# EAGLE design 4440 (EAGLE 7.5.0)
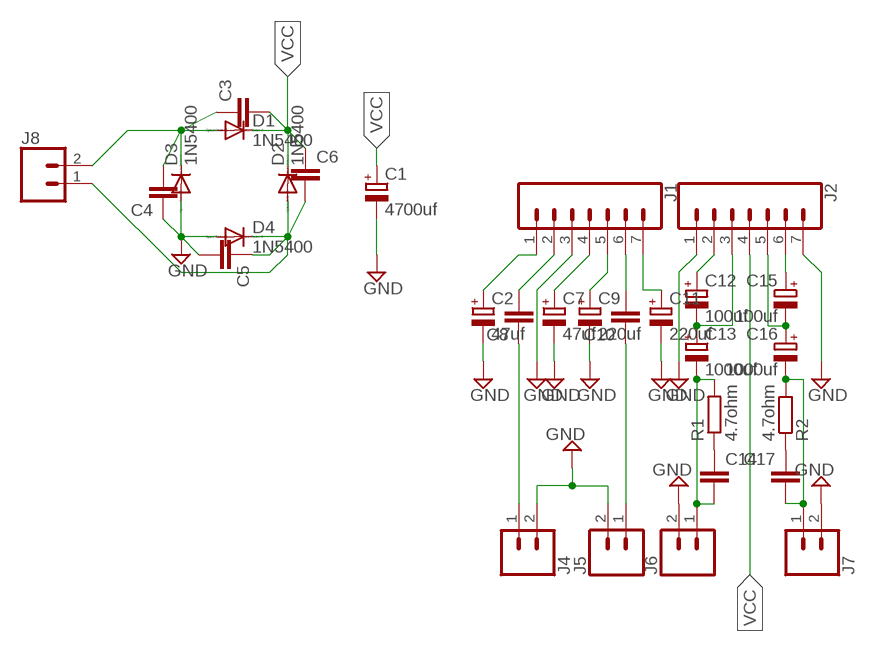
[diagram p0: schematic, sheet 1]

## Parts
C1  4700uf  CPOL-EUE7.5-16  [E7,5-16]
C2  47uf  CPOL-EUE3.5-8  [E3,5-8]
C3  C-EU050-055X075  [C050-055X075]
C4  C-EU050-055X075  [C050-055X075]
C5  C-EU050-055X075  [C050-055X075]
C6  C-EU050-055X075  [C050-055X075]
C7  47uf  CPOL-EUE3.5-8  [E3,5-8]
C8  C-EU050-055X075  [C050-055X075]
C9  220uf  CPOL-EUE3.5-8  [E3,5-8]
C10  C-EU050-055X075  [C050-055X075]
C11  220uf  CPOL-EUE3.5-8  [E3,5-8]
C12  100uf  CPOL-EUE3.5-8  [E3,5-8]
C13  1000uf  CPOL-EUE7.5-16  [E7,5-16]
C14  C-EU050-055X075  [C050-055X075]
C15  100uf  CPOL-EUE3.5-8  [E3,5-8]
C16  1000uf  CPOL-EUE7.5-16  [E7,5-16]
C17  C-EU050-055X075  [C050-055X075]
D1  1N5400  [DO201-15]
D2  1N5400  [DO201-15]
D3  1N5400  [DO201-15]
D4  1N5400  [DO201-15]
J1  CONN_07LONGPADS  [1X07_LONGPADS]
J2  CONN_07LONGPADS  [1X07_LONGPADS]
J4  CONN_023.5MM-NO_SILK  [SCREWTERMINAL-3.5MM-2-NS]
J5  CONN_023.5MM-NO_SILK  [SCREWTERMINAL-3.5MM-2-NS]
J6  CONN_023.5MM-NO_SILK  [SCREWTERMINAL-3.5MM-2-NS]
J7  CONN_023.5MM-NO_SILK  [SCREWTERMINAL-3.5MM-2-NS]
J8  CONN_023.5MM-NO_SILK  [SCREWTERMINAL-3.5MM-2-NS]
R1  4.7ohm  R-EU_0207/12  [0207/12]
R2  4.7ohm  R-EU_0207/12  [0207/12]

## Nets
GND: C1.- C2.- C4.1 C5.2 C7.- C9.- C11.- D3.A D4.A J1.3 J2.1 J2.7 J4.2 J5.2 J6.2 J7.2
N$1: C2.+ J1.1
N$2: C5.1 C6.2 D2.A D4.C J8.1
N$3: C8.2 J1.2
N$4: C3.1 C4.2 D1.A D3.C J8.2
N$5: C7.+ J1.4
N$6: C9.+ J1.5
N$7: C8.1 J4.1
N$8: C10.1 J5.1
N$9: C10.2 J1.6
N$10: C11.+ J1.7
N$11: C13.- C14.2 J6.1 R1.2
N$12: C12.+ J2.2
N$13: C12.- C13.+ J2.3
N$14: C15.+ J2.6
N$15: C14.1 R1.1
N$16: C15.- C16.+ J2.5
N$18: C17.1 R2.1
N$19: C16.- C17.2 J7.1 R2.2
VCC: C1.+ C3.2 C6.1 D1.C D2.C J2.4

## Library data of the parts
C1 C2 C7 C9 C11-C13 C15 C16 = rcl:CPOL-EU: POLARIZED CAPACITOR, European symbol
C3-C6 C8 C10 C14 C17 = rcl:C-EU: CAPACITOR, European symbol
D1-D4 = diode:1N5400: DIODE standard rectifier, 3 A, 50 V (Motorola)
J1 J2 = SparkFun-Connectors:CONN_07: Multi connection point. Often used as Generic Header-pin footprint for 0.1 inch spaced/style header connections On any of the 0.1 inch spaced packages, you can populate with these: Break Away Headers - Straight <https://www.sparkfun.com/products/116> (PRT-00116) Break Away Male Headers - Right Angle <https://www.sparkfun.com/products/553> (PRT-00553) Female Headers <https://www.sparkfun.com/products/115> (PRT-00115) Break Away Headers - Machine Pin <https://www.sparkfun.com/products/117> (PRT-00117) Break Away Female Headers - Swiss Machine Pin <https://www.sparkfun.com/products/743> (PRT-00743) For SCREWTERMINALS and SPRING TERMINALS visit here: Screw Terimnals on SparkFun.com <https://www.sparkfun.com/search/results?term=Screw+Terminals> (5mm/3.5mm/2.54mm spacing) This device is also useful as a general connection point to wire up your design to another part of your project. Our various solder wires solder well into these plated through hole pads. Hook-Up Wire - Assortment (Stranded, 22 AWG) <https://www.sparkfun.com/products/11375> (PRT-11375) Hook-Up Wire - Assortment (Solid Core, 22 AWG) <https://www.sparkfun.com/products/11367> (PRT-11367) View the entire wire category on our website here <https://www.sparkfun.com/categories/141> Special notes: Molex polarized connector foot print use with SKU : PRT-08231 with associated crimp pins and housings. 1MM SMD Version SKU: PRT-10208 NOTES ON THE VARIANTS LOCK and LOCK_LONGPADS... This footprint was designed to help hold the alignment of a through-hole component (i.e. 6-pin header) while soldering it into place. You may notice that each hole has been shifted either up or down by 0.005 of an inch from it's more standard position (which is a perfectly straight line). This slight alteration caused the pins (the squares in the middle) to touch the edges of the holes. Because they are alternating, it causes a "brace" to hold the component in place. 0.005 has proven to be the perfect amount of "off-center" position when using our standard breakaway headers. Although looks a little odd when you look at the bare footprint, once you have a header in there, the alteration is very hard to notice. Also,if you push a header all the way into place, it is covered up entirely on the bottom side.
J4-J8 = SparkFun-Retired:CONN_02: Multi connection point. Often used as Generic Header-pin footprint for 0.1 inch spaced/style header connections On any of the 0.1 inch spaced packages, you can populate with these: Break Away Headers - Straight <https://www.sparkfun.com/products/116> (PRT-00116) Break Away Male Headers - Right Angle <https://www.sparkfun.com/products/553> (PRT-00553) Female Headers <https://www.sparkfun.com/products/115> (PRT-00115) Break Away Headers - Machine Pin <https://www.sparkfun.com/products/117> (PRT-00117) Break Away Female Headers - Swiss Machine Pin <https://www.sparkfun.com/products/743> (PRT-00743) For SCREWTERMINALS and SPRING TERMINALS visit here: Screw Terimnals on SparkFun.com <https://www.sparkfun.com/search/results?term=Screw+Terminals> (5mm/3.5mm/2.54mm spacing) This device is also useful as a general connection point to wire up your design to another part of your project. Our various solder wires solder well into these plated through hole pads. Hook-Up Wire - Assortment (Stranded, 22 AWG) <https://www.sparkfun.com/products/11375> (PRT-11375) Hook-Up Wire - Assortment (Solid Core, 22 AWG) <https://www.sparkfun.com/products/11367> (PRT-11367) View the entire wire category on our website here <https://www.sparkfun.com/categories/141> Special notes: Molex polarized connector foot print use with: PRT-08233 with associated crimp pins and housings. 2.54_SCREWTERM for use with PRT-10571. 3.5mm Screw Terminal footprints for PRT-08084 5mm Screw Terminal footprints for use with PRT-08432; PROD_ID: CONN-08399
R1 R2 = resistor:R-EU_: RESISTOR, European symbol

## Board
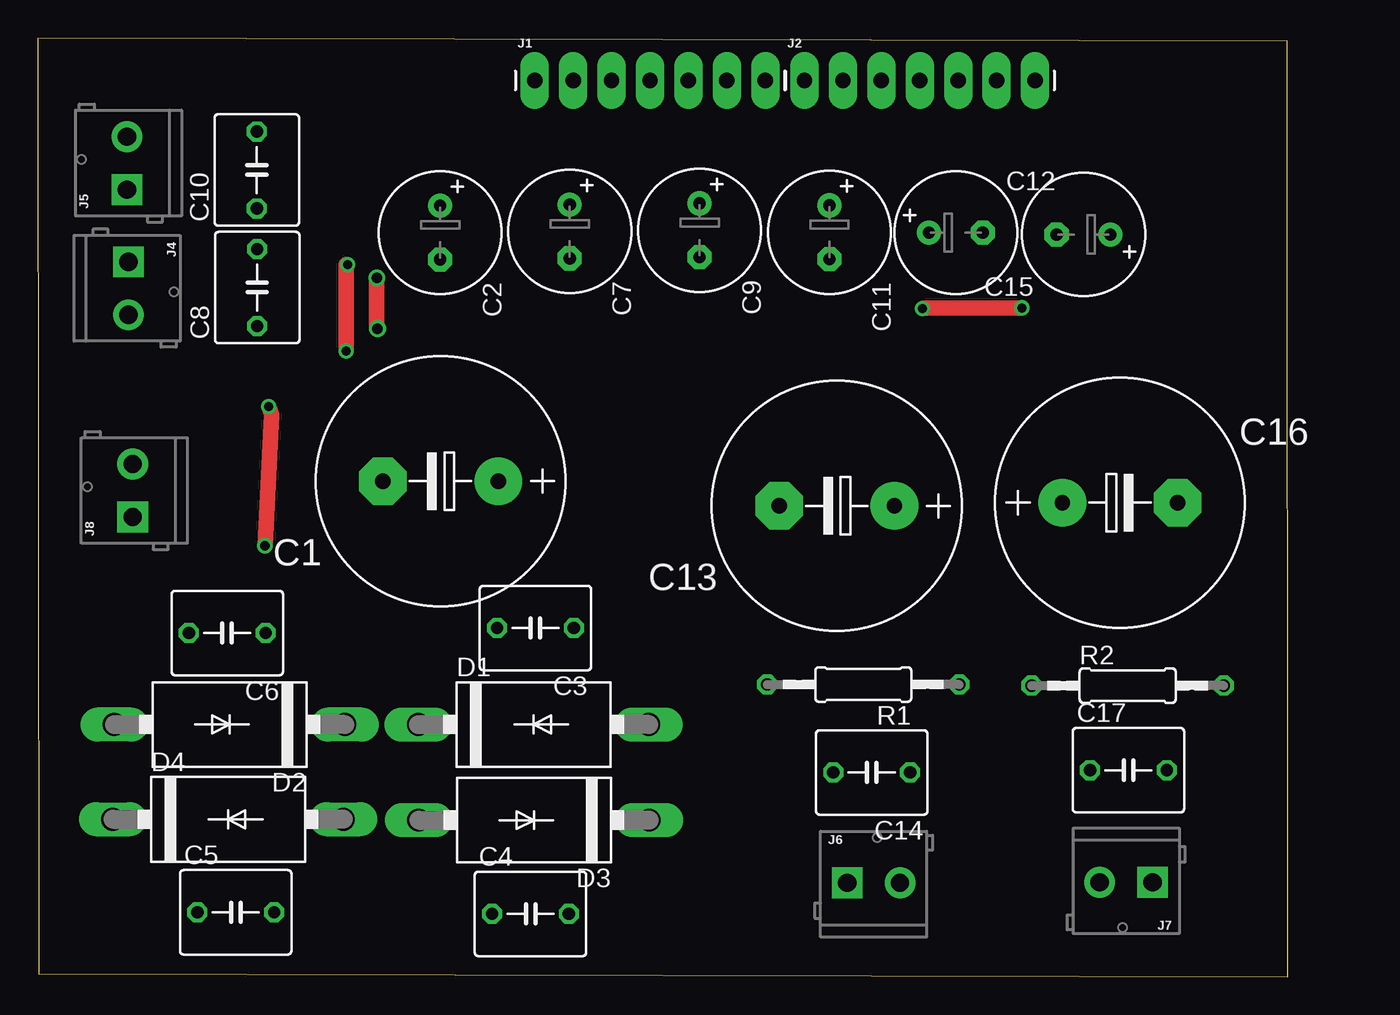
[diagram p1: board, top side]
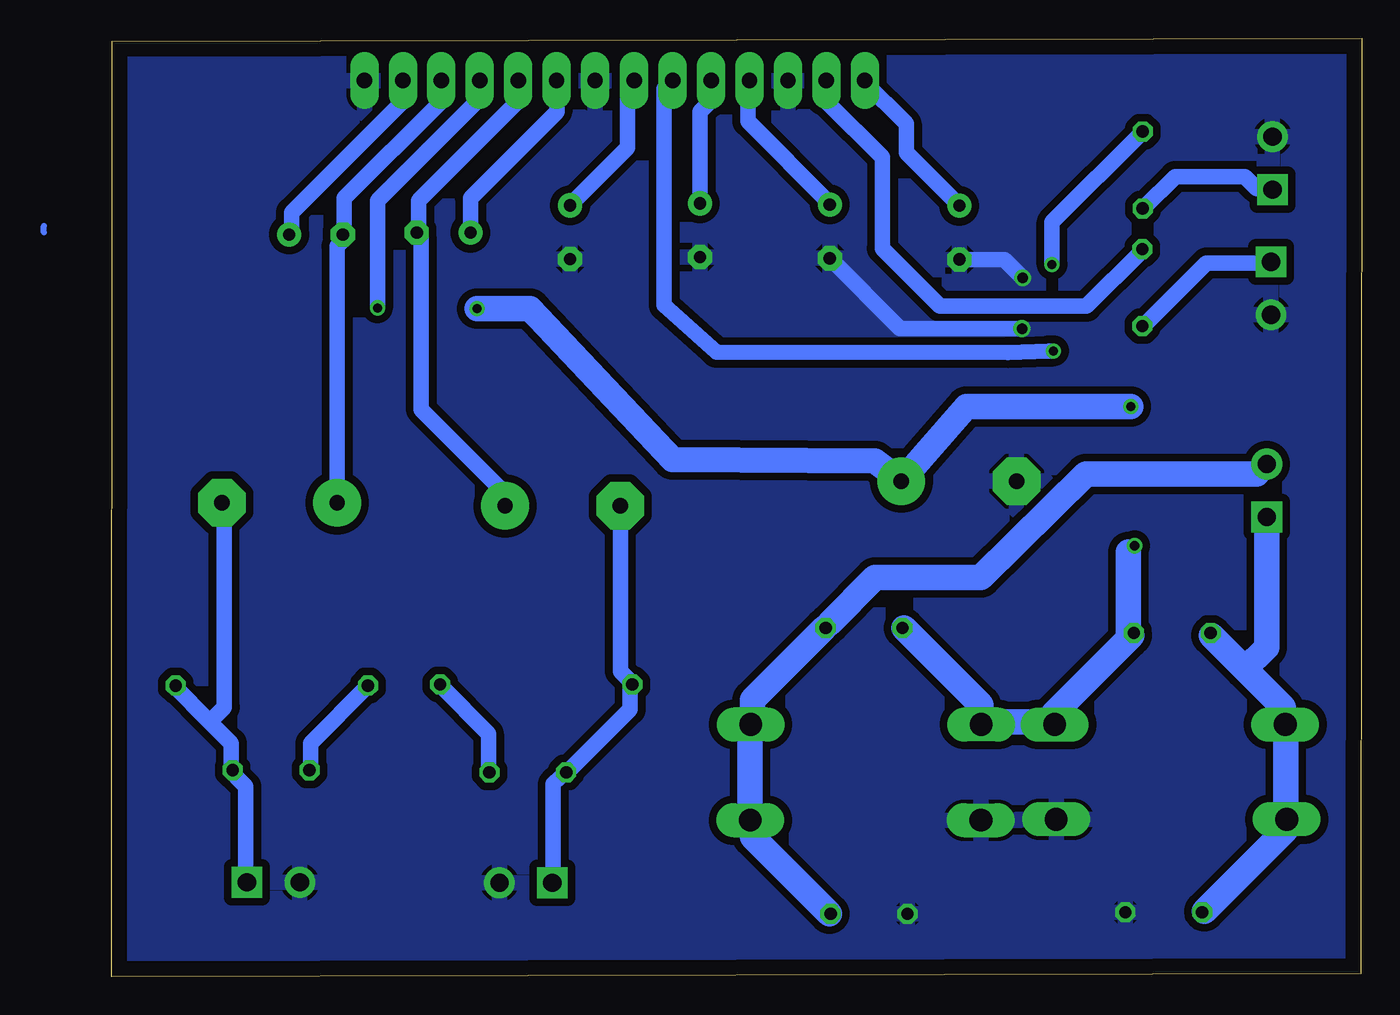
[diagram p2: board, bottom side, seen from below]

Size 82.63 x 62.04 mm. Coordinates in mm from the lower left corner, seen from the top.
Outline: 0.05,0.2 82.63,0 82.58,61.84 0,62.04 0.05,0.2
Copper layers (1*16): Top 0.035mm / dielectric 1.5mm / Bottom 0.035mm
Design rules "default *": minimum track width 40mil, minimum drill 24mil, track to track 20mil, track to pad 20mil, pad to pad 20mil, via to via 20mil, smd to smd 20mil, copper to edge 40mil, drill to drill 8mil, minimum pad ring 10mil, minimum via ring 8mil, stop-mask expansion 4mil, vias tented up to drill 0mil, thermal gap 10mil

### Footprints (pad centres in the part's own frame; a part is rotated, then mirrored left to right if it is on the bottom)
E7,5-16 = drill 1.016 pad 3.15: + -3.81,0 | drill 1.016 pad 3.15 octagon: - 3.81,0
E3,5-8 = drill 0.813 pad 1.6: + -1.778,0 | drill 0.813 pad 1.6 octagon: - 1.778,0
C050-055X075 = drill 0.813 octagon: 1 -2.54,0; 2 2.54,0
DO201-15 = drill 1.499 long: A 7.62,0; C -7.62,0
1X07_LONGPADS = drill 1.016 pad 1.88 long: 1 0,0; 2 2.54,0; 3 5.08,0; 4 7.62,0; 5 10.16,0; 6 12.7,0; 7 15.24,0
SCREWTERMINAL-3.5MM-2-NS = drill 1.2 pad 2.032 square: 1 0,0 | drill 1.2 pad 2.032: 2 3.5,0
0207/12 = drill 0.813 octagon: 1 -6.35,0; 2 6.35,0

### Placement (x,y rotation side)
C1  26.62,32.77 180 top
C2  26.59,49.2 270 top
C3  32.89,23.06 180 top
C4  32.56,4.17 0 top
C5  13.08,4.27 0 top
C6  12.52,22.73 180 top
C7  35.15,49.28 270 top
C8  14.5,45.57 90 top
C9  43.74,49.35 270 top
C10  14.48,53.34 90 top
C11  52.32,49.23 270 top
C12  60.68,49.2 0 top
C13  52.81,31.14 180 top
C14  55.12,13.51 180 top
C15  69.11,49.07 180 top
C16  71.53,31.34 0 top
C17  72.09,13.67 0 top
D1  32.77,16.69 0 top
D2  12.67,16.69 180 top
D3  32.79,10.36 180 top
D4  12.57,10.41 0 top
J1  32.84,59.26 0 top
J2  50.67,59.26 0 top
J4  5.99,47.27 270 top
J5  5.89,52.04 90 top
J6  53.49,6.22 0 top
J7  73.69,6.25 180 top
J8  6.27,30.4 90 top
R1  54.56,19.33 180 top
R2  72.03,19.25 0 top

### Tracks (layer width: path | path; a pad name or v marks a point on that pad's centre or on a via)
GND  (via drill 0.7)
  Top 1.016: v22.45,42.85 22.4,42.9 v22.4,46.2
  Bottom 1.016: C7.- 30.51,42.85 v22.45,42.85 | v22.4,46.2 23.62,47.42 C2.-
  pour Bottom: 87.02,71.04 87.25,-4.09 -3.35,-4.09 -3.28,71.17
N$1
  Bottom 1.016: C2.+ 26.61,51 30.1,54.5 30.1,56.4 32.96,59.26 J1.1
N$2
  Bottom 1.016: 5.02,9.73 5.02,10.36 D4.C 5.02,10.84 | 10.41,4.33 C5.1 | 5.18,17.82 5.18,16.71 D2.A 5.02,16.24 | 9.94,22.59 C6.2 | 6.29,30.37 J8.1
  Bottom 1.676: 5.02,9.73 10.41,4.33 | 5.18,17.82 7.71,20.36 | 7.71,20.36 9.94,22.59 | 6.29,30.37 6.29,21.79 7.71,20.36 | 5.02,16.24 5.02,10.84
N$3
  Bottom 1.016: C8.2 14.54,47.99 18.19,44.34 27.88,44.34 31.69,48.15 31.69,54.18 35.34,57.83 35.34,59.26 J1.2
N$4
  Bottom 1.016: 40.26,9.25 40.26,10.36 D3.C 40.42,10.84 | 35.18,4.17 C4.2 | 35.5,23.06 C3.1 35.18,23.38 | 40.26,16.71 D1.A 40.42,16.24 | 6.95,33.23 J8.2
  Bottom 1.676: 40.26,9.25 35.18,4.17 | 35.5,23.06 40.26,18.3 40.26,16.71 | 6.95,33.23 18.22,33.23 25.18,26.4 32.16,26.4 35.18,23.38 | 40.42,16.24 40.42,10.84
N$5
  Bottom 1.016: C7.+ 35.18,51.16 40.58,56.56 40.58,59.26 J1.4
N$6
  Bottom 1.016: C9.+ 43.75,51.16 43.75,57.19 43.12,57.83 43.12,59.26 J1.5
N$7
  Bottom 1.016: C8.1 14.38,43.07 10.25,47.19 6.13,47.19 J4.1
N$8
  Bottom 1.016: C10.1 14.38,50.84 12.32,52.91 7.71,52.91 6.92,52.11 5.97,52.11 J5.1
N$9  (via drill 0.6)
  Top 1.016: v20.37,41.38 20.37,47.09 v20.47,47.09
  Bottom 1.016: 45.67,59.26 J1.6 46.1,58.7 46.1,44.4 42.65,41.3 23.39,41.28 20.68,41.38 v20.37,41.38 | v20.47,47.09 20.47,49.89 C10.2
N$10
  Bottom 1.016: C11.+ 48.51,54.81 48.51,58.94 48.2,59.26 J1.7
N$11
  Bottom 1.016: J6.1 53.43,6.24 53.43,12.74 52.96,13.22 C14.2 52.48,13.54 48.35,17.67 48.35,19.25 R1.2 48.51,19.73 48.99,20.21 48.99,31 C13.-
N$12
  Bottom 1.016: C12.+ 58.91,51.49 53.19,57.21 53.12,59.26 J2.2
N$13
  Bottom 1.016: J2.3 55.82,59.26 55.82,57.83 62.32,51.32 62.32,49.26 C12.- 62.17,48.78 62.17,37.51 56.77,32.11 56.77,31.16 C13.+
N$14
  Bottom 1.016: C15.+ 70.74,49.1 70.74,50.53 63.44,57.83 63.44,59.26 J2.6
N$15
  Bottom 1.016: C14.1 57.72,13.54 57.72,16.08 60.9,19.25 R1.1
N$16
  Bottom 1.016: J2.5 60.9,59.26 60.9,57.83 67.25,51.48 67.25,49.1 C15.- 67.41,48.62 67.72,48.3 67.72,31.48 C16.+
N$17
  Bottom 0.406: 87.1,49.2 87.1,49.63
N$18
  Bottom 1.016: C17.1 69.47,13.7 69.47,15.44 65.66,19.25 R2.1
N$19
  Bottom 1.016: 76.14,16.87 78.52,19.25 R2.2 | 76.14,16.87 74.71,15.44 74.71,13.7 C17.2 74.39,13.22 73.76,12.59 73.76,6.39 J7.1 | 76.14,16.87 75.18,17.82 75.18,31.32 C16.-
VCC  (via drill 0.6 pad 0.81)
  Top 1.016: v65.05,44.22 58.52,44.22 v58.47,44.17 | v15.26,37.69 15.44,37.19 v15.01,28.5
  Bottom 1.016: 20.42,17.35 20.42,16.71 D2.C 20.89,16.87 | 15.18,22.59 C6.1 | 30.26,23.06 C3.2 | 25.18,16.71 D1.C | 24.7,16.87 D1.C | 25.34,16.24 D1.C | J2.4 58.29,58.06 65.05,51.31 v65.05,44.22 | v15.01,28.5 15.41,28.1
  Bottom 1.676: 20.42,17.35 15.41,22.35 | 15.41,22.35 15.18,22.59 | 30.26,23.06 25.18,17.98 25.18,16.71 | 24.7,16.87 20.89,16.87 | v58.47,44.17 54.97,44.17 45.54,34.19 32.16,34.11 C1.+ 26.14,37.69 v15.26,37.69 | 15.41,28.1 15.41,22.35